# Altium schematic sheet Sheet1.SchDoc
size A; SheetNumber: 1; SheetTotal: 1; SPICEModelCacheAMKGFCOG: <root> / <DocumentId>AMKGFCOG</DocumentId> / <CacheFrame Number="0"> / <Model Name="nmos" Kind="MDL"> / <Text>*Default N-Channel MOSFET / *Pinout: D,G,S / .MODEL NMOS NMOS()</Text> / </Model> / <Model Name="pmos" Kind="MDL"> / <Text>*Default P-Channel MOSFET / *Pinout: D,G,S / .MODEL PMOS PMOS()</Text> / </Model> / <Model Name="diode" Kind="MDL"> / <Text>*Default Diode / *Diode Pinout: A,K / .MODEL DIODE D()</Text> / </Model> / </CacheFrame> / </root>
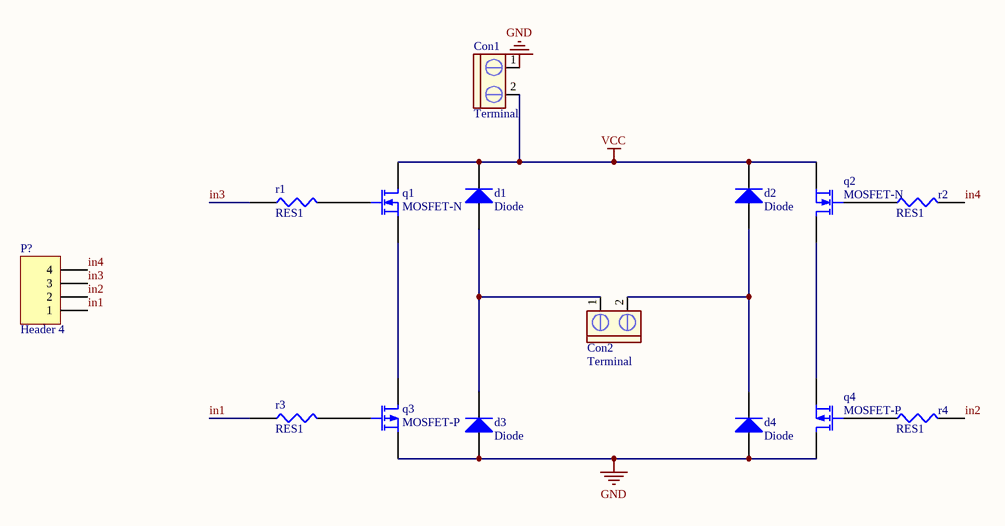
[diagram p0: Sheet1.SchDoc]

## Parts
Con1  Terminal  [Terminal Block 2 Pin]
Con2  Terminal  [Terminal Block 2 Pin]
d1  Diode  [SMC]
d2  Diode  [SMC]
d3  Diode  [SMC]
d4  Diode  [SMC]
P?  Header 4  [HDR1X4]
q1  MOSFET-N  [E3]
q2  MOSFET-N  [E3]
q3  MOSFET-P  [E3]
q4  MOSFET-P  [E3]
r1  RES1  [AXIAL0.3]
r2  RES1  [AXIAL0.3]
r3  RES1  [AXIAL0.3]
r4  RES1  [AXIAL0.3]

## Nets
GND: Con1.1 d3.1(A) d4.1(A) q3.3(S) q4.1(D)
VCC: Con1.2 d1.2(K) d2.2(K) q1.1(D) q2.3(S)
in1: P?.1 r3.1
in2: P?.2 r4.2
in3: P?.3 r1.1
in4: P?.4 r2.2
NetCon2_1: Con2.1 d1.1(A) d3.2(K)
NetCon2_2: Con2.2 d2.1(A) d4.2(K)
Netq1_2: q1.2(G) r1.2
Netq1_3: q1.3(S) q3.1(D)
Netq2_1: q2.1(D) q4.3(S)
Netq2_2: q2.2(G) r2.1
Netq3_2: q3.2(G) r3.2
Netq4_2: q4.2(G) r4.1

## Library data of the parts
Con1 Con2 = Terminal Block 2: Connector blue screw
d1-d4 = Diode: Default Diode; Published: 8-Jun-2000; LatestRevisionDate: 17-Jul-2002; LatestRevisionNote: Re-released for DXP Platform.; PackageVersion: Sep-1996; PackageReference: SMC; Publisher: Altium Limited; PackageDescription: DO-214-AB/SMC; 2 C-Bend Leads; Body 7.9 x 5.9 mm, inc. leads (LxW); Code_JEDEC: DO-214-AB
P? = Header 4: Header, 4-Pin; LatestRevisionDate: 17-Jul-2002; LatestRevisionNote: Re-released for DXP Platform.; Publisher: Altium Limited
q1 q2 = MOSFET-N: N-Channel MOSFET; Published: 8-Jun-2000; LatestRevisionDate: 17-Jul-2002; LatestRevisionNote: Re-released for DXP Platform.; PackageVersion: 1995/1996; PackageReference: E3; Publisher: Altium Limited; PackageDescription: TO, Flat Index; 3 In-Line, Axial Leads; Body Dia. 4.6mm; Lead Dia. 0.5 mm (max)
q3 q4 = MOSFET-P: P-Channel MOSFET; Published: 8-Jun-2000; LatestRevisionDate: 17-Jul-2002; LatestRevisionNote: Re-released for DXP Platform.; PackageVersion: 1995/1996; PackageReference: E3; Publisher: Altium Limited; PackageDescription: TO, Flat Index; 3 In-Line, Axial Leads; Body Dia. 4.6mm; Lead Dia. 0.5 mm (max)